# EAGLE schematic dac-board (EAGLE 9.5.1)
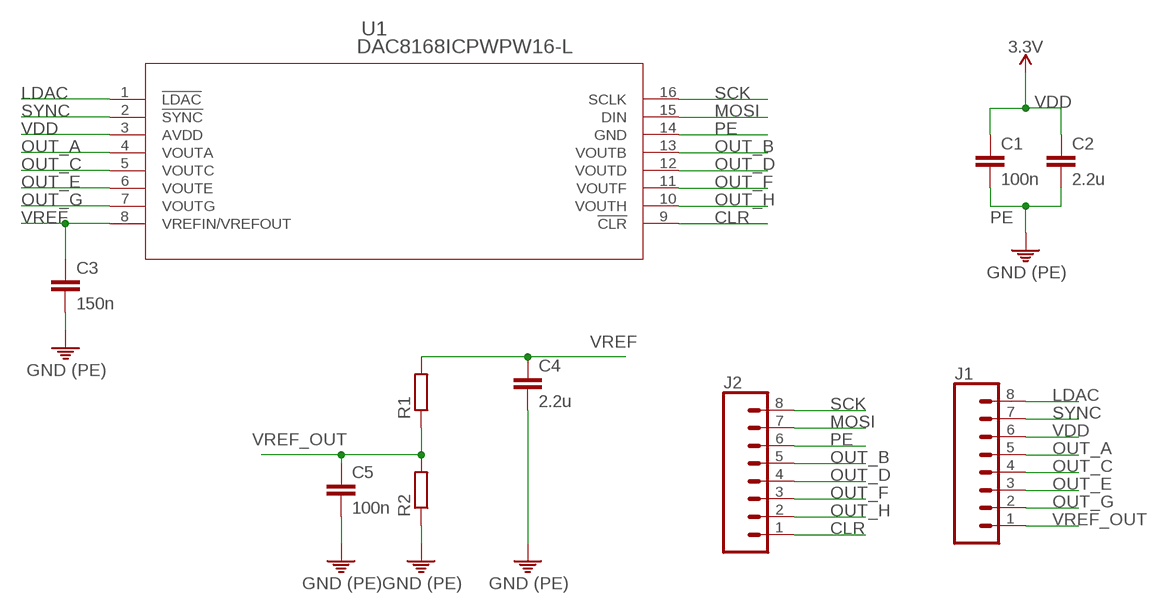
[diagram p0: schematic, sheet 1]

## Parts
C1  100n  CAPACITOR-EUC0603  [C0603]
C2  2.2u  CAPACITOR-EUC0805  [C0805]
C3  150n  CAPACITOR-EUC0603  [C0603]
C4  2.2u  CAPACITOR-EUC0805  [C0805]
C5  100n  CAPACITOR-EUC0603  [C0603]
J1  CONN_08LOCK  [1X08_LOCK]
J2  CONN_08LOCK  [1X08_LOCK]
R1  RESISTOR-EU_R0603  [R0603]
R2  RESISTOR-EU_R0603  [R0603]
U1  DAC8168ICPWPW16-L  [PW16-L]

## Nets
CLR: J2.1 U1.9(!CLR)
LDAC: J1.8 U1.1(!LDAC)
MOSI: J2.7 U1.15(DIN)
OUT_A: J1.5 U1.4(VOUTA)
OUT_B: J2.5 U1.13(VOUTB)
OUT_C: J1.4 U1.5(VOUTC)
OUT_D: J2.4 U1.12(VOUTD)
OUT_E: J1.3 U1.6(VOUTE)
OUT_F: J2.3 U1.11(VOUTF)
OUT_G: J1.2 U1.7(VOUTG)
OUT_H: J2.2 U1.10(VOUTH)
PE: C1.2 C2.2 C3.2 C4.2 C5.2 J2.6 R2.1 U1.14(GND) ; supply symbol labelled POWER-GND
SCK: J2.8 U1.16(SCLK)
SYNC: J1.7 U1.2(!SYNC)
VDD: C1.1 C2.1 J1.6 U1.3(AVDD) ; supply symbol labelled 3.3V
VREF: C3.1 C4.1 R1.2 U1.8(VREFIN/VREFOUT)
VREF_OUT: C5.1 J1.1 R1.1 R2.2

## Library data of the parts
C1-C5 = 0000-master:CAPACITOR-EU: CAPACITOR, European symbol
J1 J2 = SparkFun-Connectors:CONN_08: Multi connection point. Often used as Generic Header-pin footprint for 0.1 inch spaced/style header connections On any of the 0.1 inch spaced packages, you can populate with these: Break Away Headers - Straight <https://www.sparkfun.com/products/116> (PRT-00116) Break Away Male Headers - Right Angle <https://www.sparkfun.com/products/553> (PRT-00553) Female Headers <https://www.sparkfun.com/products/115> (PRT-00115) Break Away Headers - Machine Pin <https://www.sparkfun.com/products/117> (PRT-00117) Break Away Female Headers - Swiss Machine Pin <https://www.sparkfun.com/products/743> (PRT-00743) Arduino Stackable Header - 8 Pin <https://www.sparkfun.com/products/9279> (PRT-09279) For SCREWTERMINALS and SPRING TERMINALS visit here: Screw Terimnals on SparkFun.com <https://www.sparkfun.com/search/results?term=Screw+Terminals> (5mm/3.5mm/2.54mm spacing) This device is also useful as a general connection point to wire up your design to another part of your project. Our various solder wires solder well into these plated through hole pads. Hook-Up Wire - Assortment (Stranded, 22 AWG) <https://www.sparkfun.com/products/11375> (PRT-11375) Hook-Up Wire - Assortment (Solid Core, 22 AWG) <https://www.sparkfun.com/products/11367> (PRT-11367) View the entire wire category on our website here <https://www.sparkfun.com/categories/141> Special notes: Molex polarized connector foot print use with SKU : PRT-08231 with associated crimp pins and housings. 1MM SMD Version SKU: PRT-10208 NOTES ON THE VARIANTS LOCK and LOCK_LONGPADS... This footprint was designed to help hold the alignment of a through-hole component (i.e. 6-pin header) while soldering it into place. You may notice that each hole has been shifted either up or down by 0.005 of an inch from it's more standard position (which is a perfectly straight line). This slight alteration caused the pins (the squares in the middle) to touch the edges of the holes. Because they are alternating, it causes a "brace" to hold the component in place. 0.005 has proven to be the perfect amount of "off-center" position when using our standard breakaway headers. Although looks a little odd when you look at the bare footprint, once you have a header in there, the alteration is very hard to notice. Also,if you push a header all the way into place, it is covered up entirely on the bottom side.
R1 R2 = 0000-master:RESISTOR-EU_: RESISTOR, European symbol
U1 = 0000-master:DAC8168ICPW; BUILT_BY: EMA_UL_Team; MANUFACTURER_PART_NUMBER: DAC8168ICPW; VENDOR: Texas Instruments